# Altium schematic sheet LM35.SchDoc
size A4
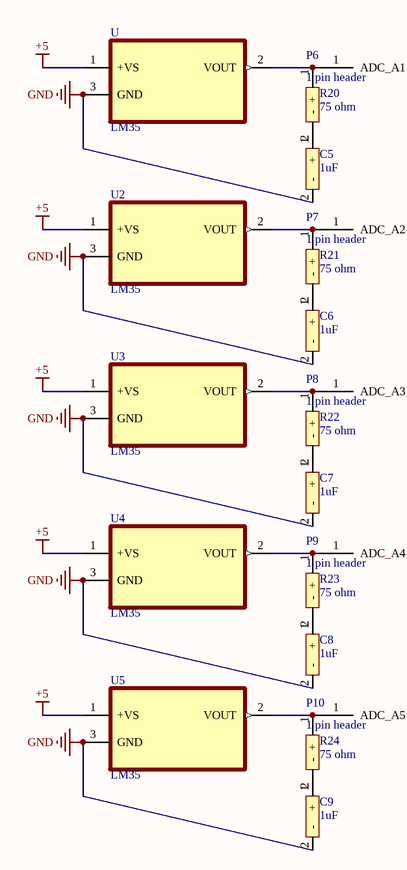
[diagram p0: LM35.SchDoc]

## Parts
C5  1uF  [10NF_KUTUPSUZ]
C6  1uF  [10NF_KUTUPSUZ]
C7  1uF  [10NF_KUTUPSUZ]
C8  1uF  [10NF_KUTUPSUZ]
C9  1uF  [10NF_KUTUPSUZ]
P6  1 pin header  [1pinheader]
P7  1 pin header  [1pinheader]
P8  1 pin header  [1pinheader]
P9  1 pin header  [1pinheader]
P10  1 pin header  [1pinheader]
R20  75 ohm  [100 resistor]
R21  75 ohm  [100 resistor]
R22  75 ohm  [100 resistor]
R23  75 ohm  [100 resistor]
R24  75 ohm  [100 resistor]
U  LM35  [TO127P254X495-3P]
U2  LM35  [TO127P254X495-3P]
U3  LM35  [TO127P254X495-3P]
U4  LM35  [TO127P254X495-3P]
U5  LM35  [TO127P254X495-3P]

## Nets
+5: U.1(+VS) U2.1(+VS) U3.1(+VS) U4.1(+VS) U5.1(+VS)
GND: C5.2(-) C6.2(-) C7.2(-) C8.2(-) C9.2(-) U.3(GND) U2.3(GND) U3.3(GND) U4.3(GND) U5.3(GND)
NetP6_1: P6.1(ADC_A1) R20.1(+) U.2(VOUT)
NetP7_1: P7.1(ADC_A2) R21.1(+) U2.2(VOUT)
NetP8_1: P8.1(ADC_A3) R22.1(+) U3.2(VOUT)
NetP9_1: P9.1(ADC_A4) R23.1(+) U4.2(VOUT)
NetP10_1: P10.1(ADC_A5) R24.1(+) U5.2(VOUT)

Not connected (* = marked no-connect by the designer): C5 1(+); C6 1(+); C7 1(+); C8 1(+); C9 1(+); R20 2(-); R21 2(-); R22 2(-); R23 2(-); R24 2(-)

## Library data of the parts
C5-C9 = 10nf_kutupsuz
R20-R24 = 100 resistor
U U2-U5 = LM35DZ/LFT4: MF: Texas Instruments; Texas_Instruments-Purchase-URL: https://snapeda.com/shop?store=Texas+Instruments&id=19434; Availability: Warning; Mouser-Purchase-URL: https://snapeda.com/shop?store=Mouser&id=19434; Price: None; DigiKey-Purchase-URL: https://snapeda.com/shop?store=DigiKey&id=19434; Package: TO-92-3 Texas Instruments; Value: *; SnapEDA_Link: https://www.snapeda.com/parts/LM35DZ/LFT4/Texas%20Instruments/view-part/19434/?ref=snap; MP: LM35DZ/LFT4; BuyPart: https://www.snapeda.com/parts/LM35DZ/LFT4/Texas%20Instruments/view-part/19434/?ref=eda